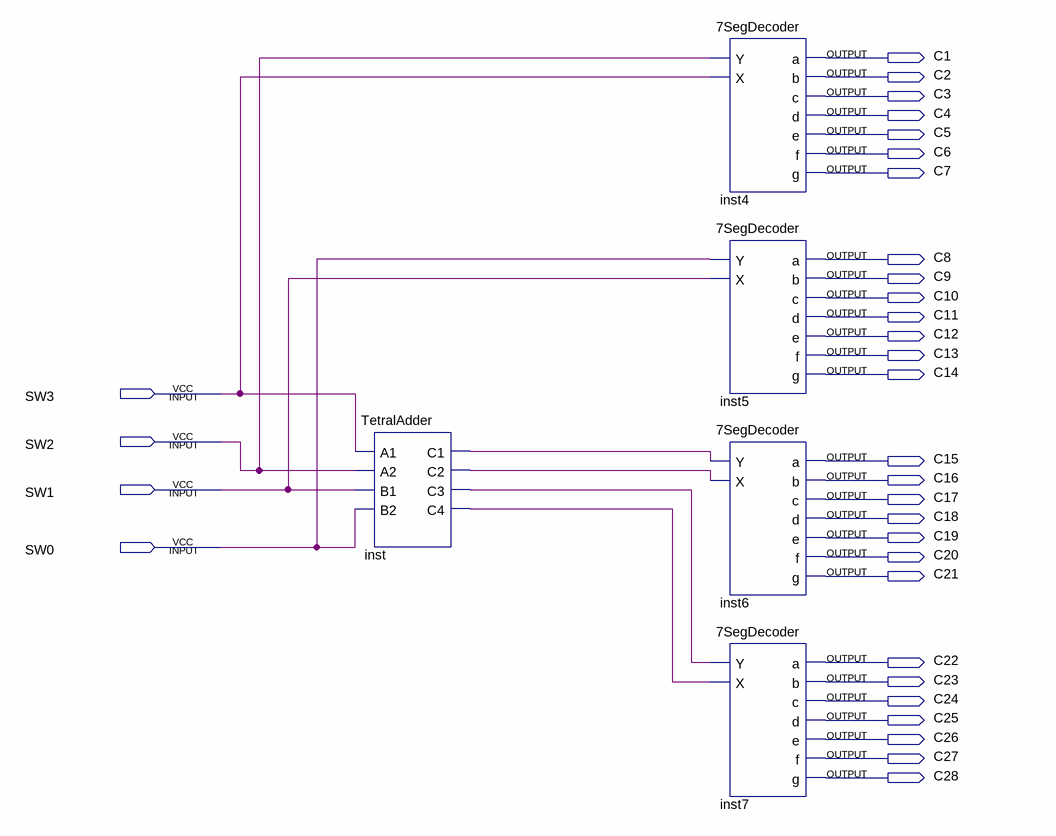
[diagram p0: schematic sheet]
// Quartus schematic FDD_Lab2.bdf as structural Verilog: 5 symbols, 32 pins
module FDD_Lab2 (
  input  SW3,
  input  SW2,
  input  SW1,
  input  SW0,
  output C1,
  output C2,
  output C3,
  output C4,
  output C5,
  output C6,
  output C7,
  output C8,
  output C9,
  output C10,
  output C11,
  output C12,
  output C13,
  output C14,
  output C15,
  output C16,
  output C17,
  output C18,
  output C19,
  output C20,
  output C21,
  output C22,
  output C23,
  output C24,
  output C25,
  output C26,
  output C27,
  output C28
);

  wire inst_c1, inst_c2, inst_c3, inst_c4;

  TetralAdder inst (.A1(SW3), .A2(SW2), .B1(SW1), .B2(SW0), .C1(inst_c1), .C2(inst_c2), .C3(inst_c3), .C4(inst_c4));
  \7SegDecoder  inst4 (.Y(SW2), .X(SW3), .a(C1), .b(C2), .c(C3), .d(C4), .e(C5), .f(C6), .g(C7));
  \7SegDecoder  inst5 (.Y(SW0), .X(SW1), .a(C8), .b(C9), .c(C10), .d(C11), .e(C12), .f(C13), .g(C14));
  \7SegDecoder  inst6 (.Y(inst_c1), .X(inst_c2), .a(C15), .b(C16), .c(C17), .d(C18), .e(C19), .f(C20), .g(C21));
  \7SegDecoder  inst7 (.Y(inst_c3), .X(inst_c4), .a(C22), .b(C23), .c(C24), .d(C25), .e(C26), .f(C27), .g(C28));
endmodule
